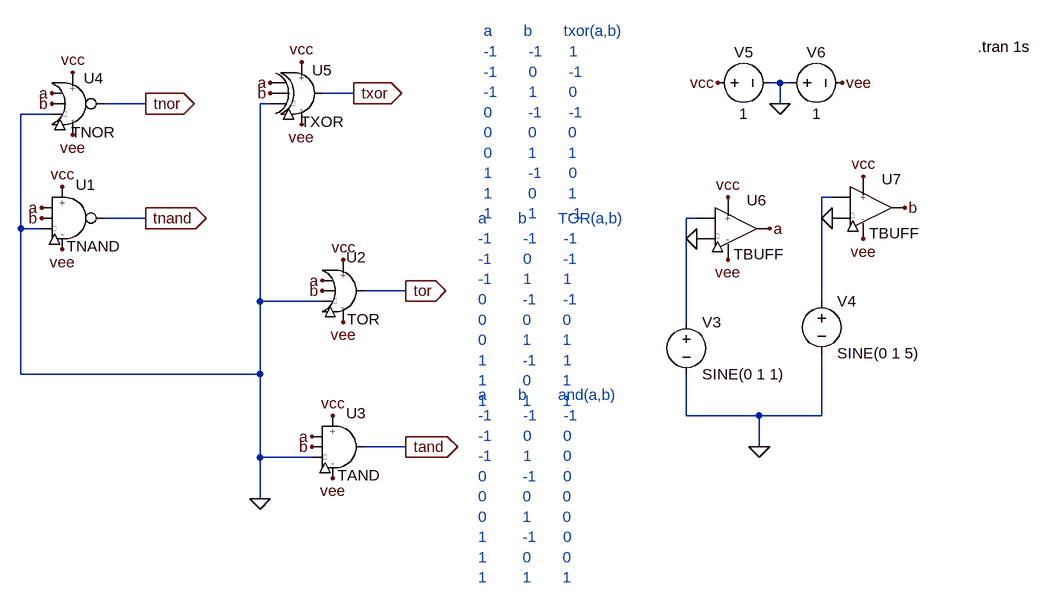
[diagram p0: schematic Test2.asc]
Test2.asc, the LTspice schematic file:
Version 4
SHEET 1 1456 680
WIRE 336 -432 320 -432
WIRE 352 -432 336 -432
WIRE -320 -416 -368 -416
WIRE -640 -400 -704 -400
WIRE -448 -400 -464 -400
WIRE 336 -400 336 -432
WIRE -784 -384 -832 -384
WIRE 416 -256 400 -256
WIRE -640 -224 -704 -224
WIRE 208 -224 192 -224
WIRE -832 -208 -832 -384
WIRE -800 -208 -832 -208
WIRE -240 -112 -304 -112
WIRE -464 -96 -464 -400
WIRE -368 -96 -464 -96
WIRE 400 -96 400 -256
WIRE 192 -64 192 -224
WIRE -832 16 -832 -208
WIRE -464 16 -464 -96
WIRE -464 16 -832 16
WIRE 192 80 192 16
WIRE 304 80 192 80
WIRE 400 80 400 -16
WIRE 400 80 304 80
WIRE -240 128 -304 128
WIRE 304 128 304 80
WIRE -464 144 -464 16
WIRE -384 144 -464 144
WIRE -464 208 -464 144
FLAG -384 112 a
FLAG -352 80 vcc
FLAG -352 176 vee
FLAG -240 128 tand
IOPIN -240 128 Out
FLAG -368 -128 a
FLAG -336 -160 vcc
FLAG -336 -64 vee
FLAG -240 -112 tor
IOPIN -240 -112 Out
FLAG -464 208 0
FLAG -384 128 b
FLAG -368 -112 b
FLAG 320 -208 a
FLAG 528 -240 b
FLAG 416 -224 0
FLAG 208 -192 0
FLAG 256 -256 vcc
FLAG 464 -288 vcc
FLAG 464 -192 vee
FLAG 256 -160 vee
FLAG -768 -272 vcc
FLAG -768 -176 vee
FLAG -800 -240 a
FLAG -800 -224 b
FLAG -640 -224 tnand
IOPIN -640 -224 Out
FLAG -784 -416 a
FLAG -784 -400 b
FLAG -752 -448 vcc
FLAG -752 -352 vee
FLAG -640 -400 tnor
IOPIN -640 -400 Out
FLAG -400 -464 vcc
FLAG -400 -368 vee
FLAG -448 -432 a
FLAG -448 -416 b
FLAG -320 -416 txor
IOPIN -320 -416 Out
FLAG 304 128 0
FLAG 432 -432 vee
FLAG 240 -432 vcc
FLAG 336 -400 0
SYMBOL voltage 192 -80 R0
SYMATTR InstName V3
SYMATTR Value SINE(0 1 1)
SYMBOL voltage 400 -112 R0
SYMATTR InstName V4
SYMATTR Value SINE(0 1 5)
SYMBOL TAND -336 128 R0
SYMATTR InstName U3
SYMBOL TOR -336 -112 R0
WINDOW 0 20 -36 Bottom 2
SYMATTR InstName U2
SYMBOL TBUFF 272 -208 R0
SYMATTR InstName U6
SYMBOL TBUFF 480 -240 R0
SYMATTR InstName U7
SYMBOL TNAND -752 -224 R0
SYMATTR InstName U1
SYMBOL TNOR -752 -400 R0
SYMATTR InstName U4
SYMBOL TXOR -400 -416 R0
SYMATTR InstName U5
SYMBOL voltage 224 -432 R270
WINDOW 0 32 56 VTop 2
WINDOW 3 -32 56 VBottom 2
SYMATTR InstName V5
SYMATTR Value 1
SYMBOL voltage 336 -432 R270
WINDOW 0 32 56 VTop 2
WINDOW 3 -32 56 VBottom 2
SYMATTR InstName V6
SYMATTR Value 1
TEXT 640 -488 Left 2 !.tran 1s
TEXT -128 48 Left 2 ;a       b       and(a,b)\n-1       -1      -1\n-1       0       0\n-1       1       0\n0        -1      0\n0        0       0\n0        1       0\n1        -1      0\n1        0       0\n1        1       1
TEXT -128 -224 Left 2 ;a       b       TOR(a,b)\n-1       -1      -1\n-1       0       -1\n-1       1       1\n0        -1      -1\n0        0       0\n0        1       1\n1        -1      1\n1        0       1\n1        1       1
TEXT -120 -512 Left 2 ;a       b       txor(a,b)\n-1       -1      1\n-1       0       -1\n-1       1       0\n0        -1      -1\n0        0       0\n0        1       1\n1        -1      0\n1        0       1\n1        1       -1

The netlist it stands for:
* Test2.asc
V3 N002 0 SINE(0 1 1)
V4 N001 0 SINE(0 1 5)
XU3 a b vcc vee tand 0 TAND  ; pins a b vcc vee out gnd
XU2 a b vcc vee tor 0 TOR  ; pins a b vcc vee out gnd
XU6 N002 vcc vee a 0 TBUFF  ; pins in vcc vee out gnd
XU7 N001 vcc vee b 0 TBUFF  ; pins in vcc vee out gnd
XU1 a b vcc vee tnand 0 TNAND  ; pins a b vcc vee out gnd
XU4 a b vcc vee tnor 0 TNOR  ; pins a b vcc vee out gnd
XU5 a b vcc vee txor 0 TXOR  ; pins a b vcc vee out gnd
V5 vcc 0 1
V6 0 vee 1
.tran 1s
* a       b       and(a,b)
* -1       -1      -1
* -1       0       0
* -1       1       0
* 0        -1      0
* 0        0       0
* 0        1       0
* 1        -1      0
* 1        0       0
* 1        1       1
* a       b       TOR(a,b)
* -1       -1      -1
* -1       0       -1
* -1       1       1
* 0        -1      -1
* 0        0       0
* 0        1       1
* 1        -1      1
* 1        0       1
* 1        1       1
* a       b       txor(a,b)
* -1       -1      1
* -1       0       -1
* -1       1       0
* 0        -1      -1
* 0        0       0
* 0        1       1
* 1        -1      0
* 1        0       1
* 1        1       -1
.lib /Users/manoelribeiroalmeida/dev/trit/LTspice/TAND.sub
.lib /Users/manoelribeiroalmeida/dev/trit/LTspice/TOR.sub
.lib /Users/manoelribeiroalmeida/dev/trit/LTspice/TBUFF.sub
.lib /Users/manoelribeiroalmeida/dev/trit/LTspice/TNAND.sub
.lib /Users/manoelribeiroalmeida/dev/trit/LTspice/TNOR.sub
.lib /Users/manoelribeiroalmeida/dev/trit/LTspice/TXOR.sub
.backanno
.end